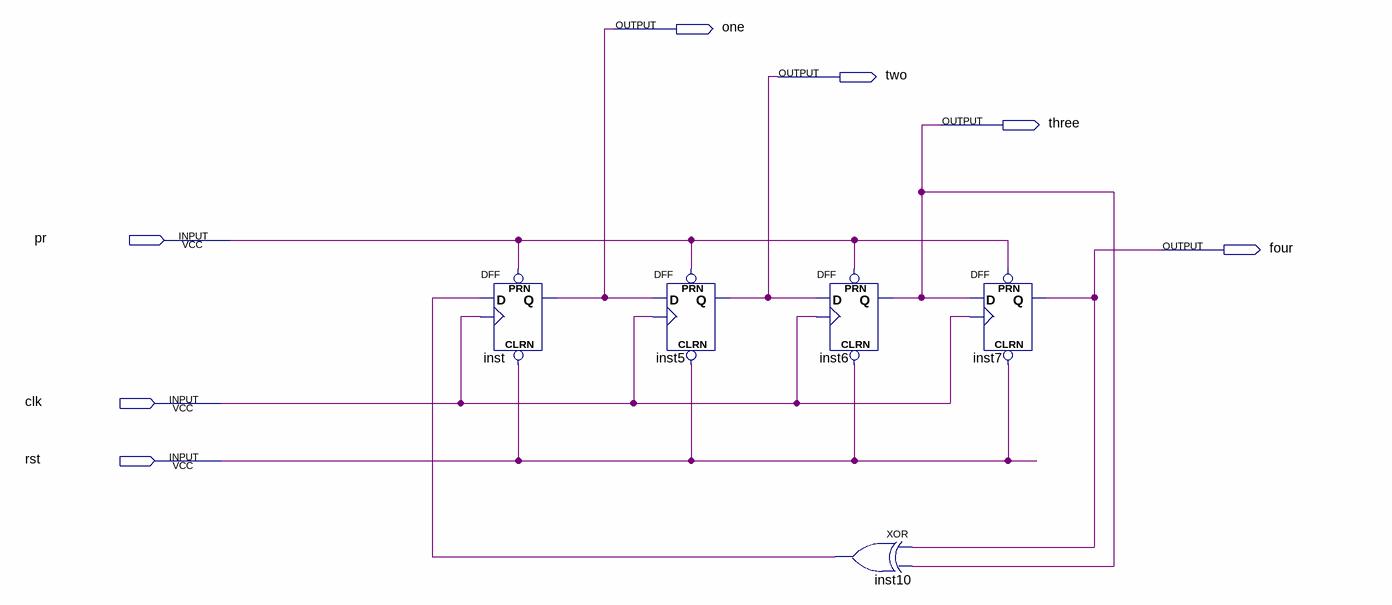
[diagram p0: schematic sheet]
// Quartus schematic random.bdf as structural Verilog: 5 symbols, 7 pins
module random (
  input  pr,
  input  clk,
  input  rst,
  output one,
  output two,
  output three,
  output four
);

  wire inst10_out;

  DFF inst (.CLRN(rst), .CLK(clk), .D(inst10_out), .PRN(pr), .Q(one));
  DFF inst5 (.CLRN(rst), .CLK(clk), .D(one), .PRN(pr), .Q(two));
  DFF inst6 (.CLRN(rst), .CLK(clk), .D(two), .PRN(pr), .Q(three));
  xor inst10 (inst10_out, four, three);
  DFF inst7 (.CLRN(rst), .CLK(clk), .D(three), .PRN(pr), .Q(four));
endmodule
